# Altium schematic sheet Sheet1.SchDoc
size A4
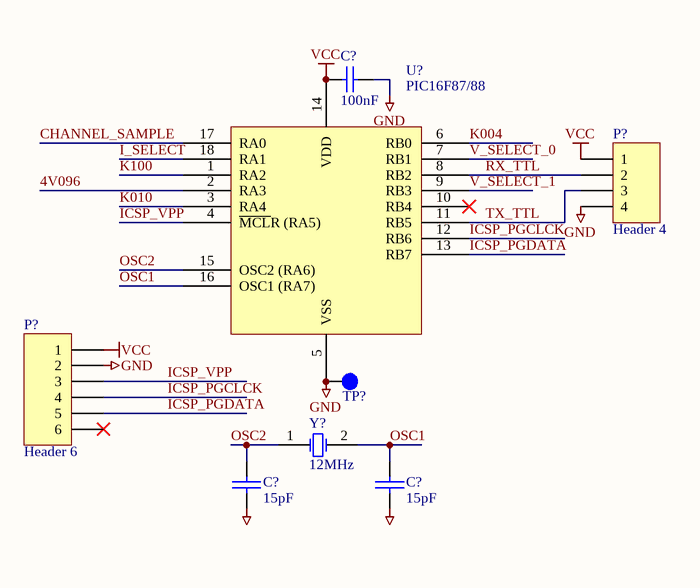
[diagram p0: Sheet1.SchDoc]

## Parts
(Parts that share a designator on the sheet are numbered #1, #2 ... from top to bottom, then left to right.)
C?#1  100nF  [CAP (3D) - 0805]
C?#2  15pF  [CAP (3D) - 0805]
C?#3  15pF  [CAP (3D) - 0805]
P?#1  Header 4  [HDR1X4]
P?#2  Header 6  [HDR1X6]
TP?  TestPoint  [TP]  (value not drawn)
U?  PIC16F87/88  [SOIC-18]
Y?  12MHz  [HC49/4H_SMX]

## Nets
GND: C?#1.2 C?#2.2 C?#3.2 P?#1.4 P?#2.2 TP?.1 U?.5(VSS)
VCC: C?#1.1 P?#1.1 P?#2.1 U?.14(VDD)
4V096: U?.2(RA3)
CHANNEL_SAMPLE: U?.17(RA0)
I_SELECT: U?.18(RA1)
ICSP_PGCLCK: P?#2.4 U?.12(RB6)
ICSP_PGDATA: P?#2.5 U?.13(RB7)
ICSP_VPP: P?#2.3 U?.4(~{MCL}R_(RA5))
K004: U?.6(RB0)
K010: U?.3(RA4)
K100: U?.1(RA2)
OSC1: C?#3.1 U?.16(OSC1_(RA7)) Y?.2(OSC2)
OSC2: C?#2.1 U?.15(OSC2_(RA6)) Y?.1(OSC1)
RX_TTL: P?#1.2 U?.8(RB2)
TX_TTL: P?#1.3 U?.11(RB5)
V_SELECT_0: U?.7(RB1)
V_SELECT_1: U?.9(RB3)

Not connected (* = marked no-connect by the designer): P?#2 6*; U? 10(RB4)*

## Library data of the parts
C?#1 = Cap: Capacitor; Value: 100nF; Supplier 1: Mouser; Supplier 2: Digi-Key; Supplier Part Number 1: 603-C0603ZRY5V9BB104; Supplier Part Number 2: 311-1343-2-ND
C?#2 C?#3 = CAP: CAPACITOR SMD 0402; Manufacturer: Xicon; Manufacturer Part No.: 140-CC504N150J-RC; value: 15pF; Mouser Part no.: 140-CC504N150J-RC; Web link: http://au.mouser.com/ProductDetail/Xicon/140-CC504N150J-RC/?qs=0ZUpllj3bsY%252bl3b%252btrhy8ZRrWnFRAos3
P?#1 = Header 4: Header, 4-Pin; LatestRevisionDate: 17-Jul-2002; LatestRevisionNote: Re-released for DXP Platform.; Publisher: Altium Limited
P?#2 = Header 6: Header, 6-Pin; LatestRevisionDate: 17-Jul-2002; LatestRevisionNote: Re-released for DXP Platform.; Publisher: Altium Limited
U? = PIC16F87/88: PIC16F88; Manufacturer: Microchip Technology; Manufacturer Part No.: PIC16F88-E/SS; Mouser Part no.: 579-PIC16F88-E/SS; Farnell Part no.: 9761519; value: PIC16F88; Web link: http://au.mouser.com/ProductDetail/Microchip-Technology/PIC16F88-E-SS/?qs=sGAEpiMZZMvu0Nwh4cA1waDrdroEY0RCb%252bRi%252b4Dz0K0%3d
Y? = XTAL: Crystal Oscillator; Manufacturer: ECS; Manufacturer Part No.: ECS-160-20-5PX-TR; value: 16MHz; Mouser Part no.: 520-CSM1600-20-X; Web link: http://au.mouser.com/ProductDetail/ECS/ECS-160-20-5PX-TR/?qs=CkbNAJEAr%2fRSmE52Hssuc4XnCMYWVt7B